# EAGLE design CC2564MODACMOG_1L (EAGLE 9.6.2)
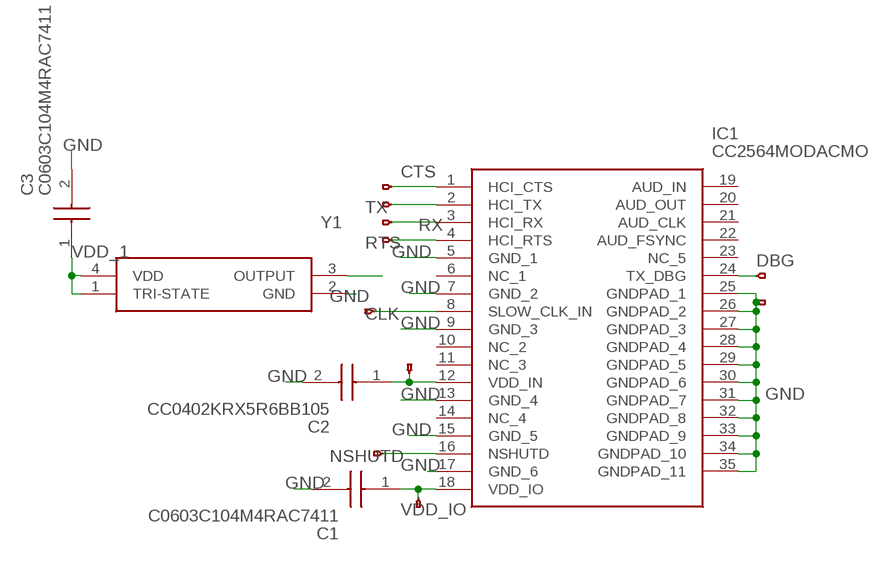
[diagram p0: schematic, sheet 1]

## Parts
C1  C0603C104M4RAC7411  [CAPC1608X95N]
C2  CC0402KRX5R6BB105  [CAPC1005X55N]
C3  C0603C104M4RAC7411  [CAPC1608X95N]
IC1  CC2564MODACMOG  [MOG0035A]
JP1  HEADERHOLE-HEADERHOLE  [1X1-HEADER-HOLE]
JP2  HEADERHOLE-HEADERHOLE  [1X1-HEADER-HOLE]
JP7  HEADERHOLE-HEADERHOLE  [1X1-HEADER-HOLE]
JP8  HEADERHOLE-HEADERHOLE  [1X1-HEADER-HOLE]
JP9  HEADERHOLE-HEADERHOLE  [1X1-HEADER-HOLE]
JP10  HEADERHOLE-HEADERHOLE  [1X1-HEADER-HOLE]
JP11  HEADERHOLE-HEADERHOLE  [1X1-HEADER-HOLE]
JP12  HEADERHOLE-HEADERHOLE  [1X1-HEADER-HOLE]
JP13  HEADERHOLE-HEADERHOLE  [1X1-HEADER-HOLE]
JP14  HEADERHOLE-HEADERHOLE  [1X1-HEADER-HOLE]
Y1  ECS-327MVATX-1-CN-TR  [ECS327MVATX1CNTR]

## Nets
CLK: IC1.8(SLOW_CLK_IN) JP11.1
CTS: IC1.1(HCI_CTS) JP7.1
DBG: IC1.24(TX_DBG) JP2.1
GND: C1.2 C2.2(C2) C3.2 IC1.5(GND_1) IC1.7(GND_2) IC1.9(GND_3) IC1.13(GND_4) IC1.15(GND_5) IC1.17(GND_6) IC1.25(GNDPAD_1) IC1.26(GNDPAD_2) IC1.27(GNDPAD_3) IC1.28(GNDPAD_4) IC1.29(GNDPAD_5) IC1.30(GNDPAD_6) IC1.31(GNDPAD_7) IC1.32(GNDPAD_8) IC1.33(GNDPAD_9) IC1.34(GNDPAD_10) IC1.35(GNDPAD_11) JP1.1 Y1.2(GND)
N$1: Y1.3(OUTPUT)
NSHUTD: IC1.16(NSHUTD) JP14.1
RTS: IC1.4(HCI_RTS) JP10.1
RX: IC1.3(HCI_RX) JP9.1
TX: IC1.2(HCI_TX) JP8.1
VDD: C2.1(C1) IC1.12(VDD_IN) JP12.1
VDD_1: C3.1 Y1.1(TRI-STATE) Y1.4(VDD)
VDD_IO: C1.1 IC1.18(VDD_IO) JP13.1
Unconnected: IC1.6(NC_1) IC1.10(NC_2) IC1.11(NC_3) IC1.14(NC_4) IC1.19(AUD_IN) IC1.20(AUD_OUT) IC1.21(AUD_CLK) IC1.22(AUD_FSYNC) IC1.23(NC_5)

## Library data of the parts
C1 C3 = C0603C104M4RAC7411_100nF:C0603C104M4RAC7411: KEMET - C0603C104M4RAC7411 - CAP, 0.1F, 16V, 20%, X7R, 0603 Source: Datasheet <https://www.mouser.com/datasheet/2/212/KEM_C1023_X7R_AUTO_SMD-1093309.pdf>; DESCRIPTION: KEMET - C0603C104M4RAC7411 - CAP, 0.1F, 16V, 20%, X7R, 0603; HEIGHT: 0.95mm; MANUFACTURER_NAME: Kemet; MANUFACTURER_PART_NUMBER: C0603C104M4RAC7411; MOUSER_PART_NUMBER: 80-C0603C104M4R7411; MOUSER_PRICE-STOCK: https://www.mouser.com/Search/Refine.aspx?Keyword=80-C0603C104M4R7411
C2 = CC0402KRX5R6BB105_1UF:CC0402KRX5R6BB105: CAPACITOR, 0402 1uF +/-10% 10V Source: Datasheet <http://componentsearchengine.com/Datasheets/1/CC0402KRX5R6BB105.pdf>; DESCRIPTION: CAPACITOR, 0402 1uF +/-10% 10V; HEIGHT: mm; MANUFACTURER_NAME: YAGEO (PHYCOMP); MANUFACTURER_PART_NUMBER: CC0402KRX5R6BB105; MOUSER_PART_NUMBER: 603-CC402KRX5R6BB105; MOUSER_PRICE-STOCK: https://www.mouser.com/Search/Refine.aspx?Keyword=603-CC402KRX5R6BB105
IC1 = CC2564MODACMOG:CC2564MODACMOG: Dual-mode Bluetooth® CC2564 module with integrated antenna Source: Datasheet <http://www.ti.com/lit/ds/symlink/cc2564moda.pdf>; ARROW_PART_NUMBER: CC2564MODACMOG; ARROW_PRICE-STOCK: https://www.arrow.com/en/products/cc2564modacmog/texas-instruments; DESCRIPTION: Dual-mode Bluetooth&#174; CC2564 module with integrated antenna; HEIGHT: mm; MANUFACTURER_NAME: Texas Instruments; MANUFACTURER_PART_NUMBER: CC2564MODACMOG; MOUSER_PART_NUMBER: 595-CC2564MODACMOG; MOUSER_PRICE-STOCK: https://www.mouser.co.uk/ProductDetail/Texas-Instruments/CC2564MODACMOG?qs=tCMd4XlZ%2FiD0qx2OJWZ%2FcQ%3D%3D
JP1 JP2 JP7-JP14 = F405Pill:HEADERHOLE
Y1 = ECS-327MVATX-1-CN-TR:ECS-327MVATX-1-CN-TR: Standard Clock Oscillators Source: Datasheet <https://componentsearchengine.com/Datasheets/1/ECS-327MVATX-1-CN-TR.pdf>; ARROW_PART_NUMBER: ECS-327MVATX-1-CN-TR; ARROW_PRICE-STOCK: https://www.arrow.com/en/products/ecs-327mvatx-1-cn-tr/ecs-international; DESCRIPTION: Standard Clock Oscillators; HEIGHT: 1mm; MANUFACTURER_NAME: ECS; MANUFACTURER_PART_NUMBER: ECS-327MVATX-1-CN-TR; MOUSER_PART_NUMBER: 520-327MVATX-1-CNT; MOUSER_PRICE-STOCK: https://www.mouser.co.uk/ProductDetail/ECS/ECS-327MVATX-1-CN-TR?qs=T3oQrply3y9WKu0EtqPfmQ%3D%3D

## Board
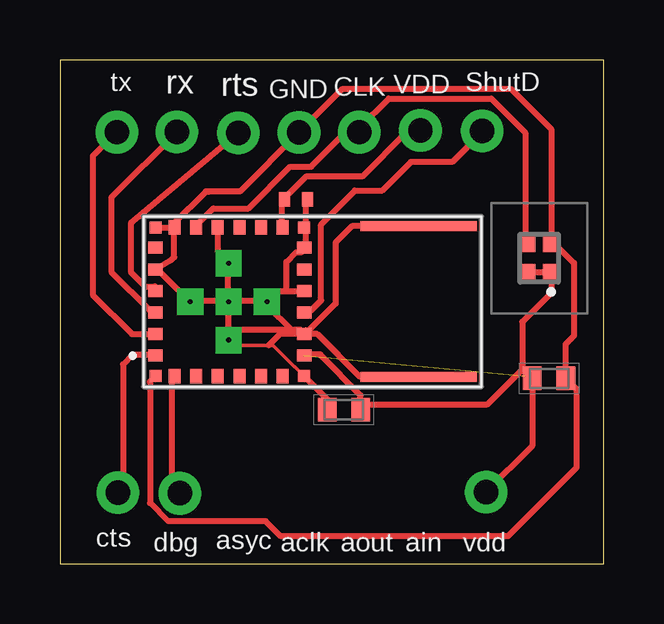
[diagram p1: board, top side]
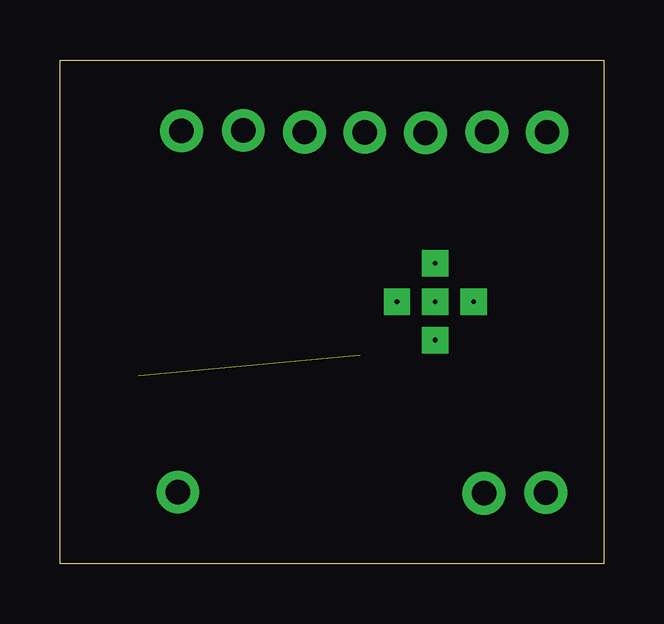
[diagram p2: board, bottom side, seen from below]

Size 22.68 x 21 mm. Coordinates in mm from the lower left corner, seen from the top.
Outline: 0,0 22.68,0 22.68,21 0,21 0,0
Copper layers (1*16): Top 0.035mm / dielectric 1.5mm / Bottom 0.035mm
Design rules "default *": minimum track width 6mil, minimum drill 0.35mm, track to track 6mil, track to pad 6mil, pad to pad 6mil, via to via 6mil, smd to smd 6mil, copper to edge 40mil, drill to drill 6mil, minimum pad ring 10mil, minimum via ring 8mil, stop-mask expansion 4mil, vias tented up to drill 0mil, thermal gap 10mil

### Footprints (pad centres in the part's own frame; a part is rotated, then mirrored left to right if it is on the bottom)
CAPC1608X95N = smd 0.78 x 0.98: 1 -0.7,0; 2 0.7,0
CAPC1005X55N = smd 0.457 x 0.61: 1 -0.483,0; 2 0.483,0
MOG0035A = smd 0.6 x 0.5: 1 -6.55,-2.25; 2 -6.55,-1.35; 3 -6.55,-0.45; 4 -6.55,0.45; 5 -6.55,1.35; 6 -6.55,2.25; 13 -0.35,2.25; 14 -0.35,1.35; 15 -0.35,0.45; 16 -0.35,-0.45; 17 -0.35,-1.35; 18 -0.35,-2.25 | smd 0.5 x 0.6: 7 -5.75,3.1; 8 -4.85,3.1; 9 -3.95,3.1; 10 -3.05,3.1; 11 -2.15,3.1; 12 -1.25,3.1; 19 -1.25,-3.1; 20 -2.15,-3.1; 21 -3.05,-3.1; 22 -3.95,-3.1; 23 -4.85,-3.1; 24 -5.75,-3.1 | drill 0.2 pad 1.1 square: 25 -5.1,0; 26 -3.5,1.6; 27 -3.5,0; 28 -3.5,-1.6; 29 -1.9,0 | smd 0.5 x 0.5: 30 -6.55,-3.1; 31 -6.55,3.1; 32 -0.35,3.1; 33 -0.35,-3.1 | smd 4.85 x 0.43: 34 4.425,-3.135; 35 4.425,3.15
1X1-HEADER-HOLE = drill 1.016 pad 1.778: 1 0,0
ECS327MVATX1CNTR = smd 0.8 x 0.7: 1 -0.65,-0.5; 2 0.65,-0.5; 3 0.65,0.5; 4 -0.65,0.5

### Placement (x,y rotation side)
C1  20.39,7.72 0 top
C2  9.85,15.18 0 top
C3  11.84,6.42 180 top
IC1  10.53,10.92 0 top
JP1  9.97,17.98 0 top
JP2  5,2.93 0 top
JP7  2.42,2.96 0 top
JP8  2.37,17.99 0 top
JP9  4.88,18 0 top
JP10  7.44,17.96 0 top
JP11  12.48,17.99 0 top
JP12  15.03,18.06 0 top
JP13  17.77,2.98 0 top
JP14  17.61,18.04 0 top
Y1  19.98,12.73 90 top

### Tracks (layer width: path | path; a pad name or v marks a point on that pad's centre or on a via)
CLK
  Top 0.254: IC1.8 5.68,14.1 6.39,14.81 7.86,14.81 9.6,16.55 10.48,16.55 11.84,17.92 JP11.1 12.5,18.17 13.72,19.39 17.98,19.39 19.4,17.97 19.4,13.55
CTS
  Top 0.254: IC1.1 3.96,8.71 3.04,8.71 2.63,8.31 2.63,3.17 JP7.1
DBG
  Top 0.254: IC1.24 4.65,7.69 4.65,3.28 JP2.1
GND
  Top 0.152: IC1.33 9.81,8.19 9.79,8.19 8.88,9.1 8.7,9.1 7.25,9.1 IC1.28
  Top 0.254: 4.57,14 4.77,14 IC1.7 | 4.57,14 4.16,14 IC1.31 | 3.96,7.9 IC1.30 3.75,7.59 3.75,2.53 4.52,1.76 8.58,1.76 9.2,1.14 18.68,1.14 21.54,4 21.54,7.27 C1.2 21.09,9.15 21.44,9.5 21.44,12.53 20.62,13.35 Y1.2 20.48,18.12 18.8,19.8 11.79,19.8 JP1.1 | 4.77,14.02 4.77,12.78 4.62,12.64 IC1.5 4.16,12.17 5.38,10.95 IC1.25 5.58,10.95 7.01,10.95 | 4.57,14 4.77,14.02 | 4.77,14.02 IC1.7 | 6.07,15.5 4.77,14.2 IC1.7 | 14.95,7.8 IC1.34 | 15.13,7.7 15.03,7.75 14.99,7.79 IC1.34 | IC1.9 6.6,14 6.6,12.98 7.01,12.58 IC1.26 7.01,12.37 7.01,10.95 | 7.01,9.32 7.01,10.75 IC1.27 | 7.01,9.32 IC1.28 | 10.26,9.73 IC1.17 | C2.2 10.26,15.01 10.26,14.2 IC1.32 10.26,14 10.26,13.19 IC1.13 10.05,12.98 9.85,12.98 9.44,12.58 9.44,11.36 | 9.44,11.36 9.04,11.36 8.63,10.95 IC1.29 | 9.44,11.36 10.05,11.36 IC1.15 | 9.65,9.73 10.05,9.73 IC1.17 | 9.65,9.73 8.63,10.75 IC1.29 | IC1.27 7.21,10.95 8.43,10.95 IC1.29 | 7.01,10.95 IC1.27 | IC1.35 12.17,14.07 11.49,13.39 11.49,10.84 10.22,9.57 IC1.17 | IC1.17 10.73,9.57 12.52,7.79 IC1.34 | IC1.33 11.14,6.86 C3.2 11.27,6.42 | 6.07,15.5 6.08,15.52 7.51,15.52 JP1.1 | 6.2,15.5 6.07,15.5 | 9.65,9.73 7.41,9.73 7.01,9.32 | IC1.17 9.17,9.57 8.7,9.1 | JP1.1 9.95,17.98
  Bottom 0.254: 5.38,10.75 IC1.25
NSHUTD
  Top 0.254: IC1.16 10.26,10.54 10.46,10.54 10.89,10.97 10.89,14.14 12.3,15.56 13.44,15.56 14.63,16.75 16.36,16.75 17.58,17.97 JP14.1
RTS
  Top 0.254: IC1.4 3.96,11.56 3.55,11.56 2.95,12.16 2.95,14.19 JP10.1
RX
  Top 0.254: JP9.1 2.14,15.26 2.14,12.16 3.75,10.54 3.96,10.54 IC1.3
TX
  Top 0.254: JP8.1 1.37,16.99 1.37,11.2 3,9.57 IC1.2
VDD
  Top 0.254: IC1.12 9.24,14.2 9.24,15.01 C2.1 9.32,15.2 10.27,16.14 12.61,16.14 14.44,17.97 14.94,17.97 JP12.1
VDD_1
  Top 0.254: Y1.4 19.61,12.13 20.42,12.13 Y1.1 20.48,11.28 19.28,10.08 19.28,8.1 18.9,7.72 17.8,6.62 12.74,6.62 C3.1 12.54,7.02 10.88,8.68 10.88,8.71 10.26,8.71
VDD_IO  (1 unrouted)
  Top 0.254: 10.05,8.71 IC1.18 | 19.39,7.82 19.49,7.72 C1.1 19.69,4.9 JP13.1

### Text on the board
tNames: tx | rx | rts | CLK | VDD | ShutD | GND | cts | asyc | dbg | aclk | aout | ain | vdd